# Altium schematic sheet CoreBoard.SchDoc
size B
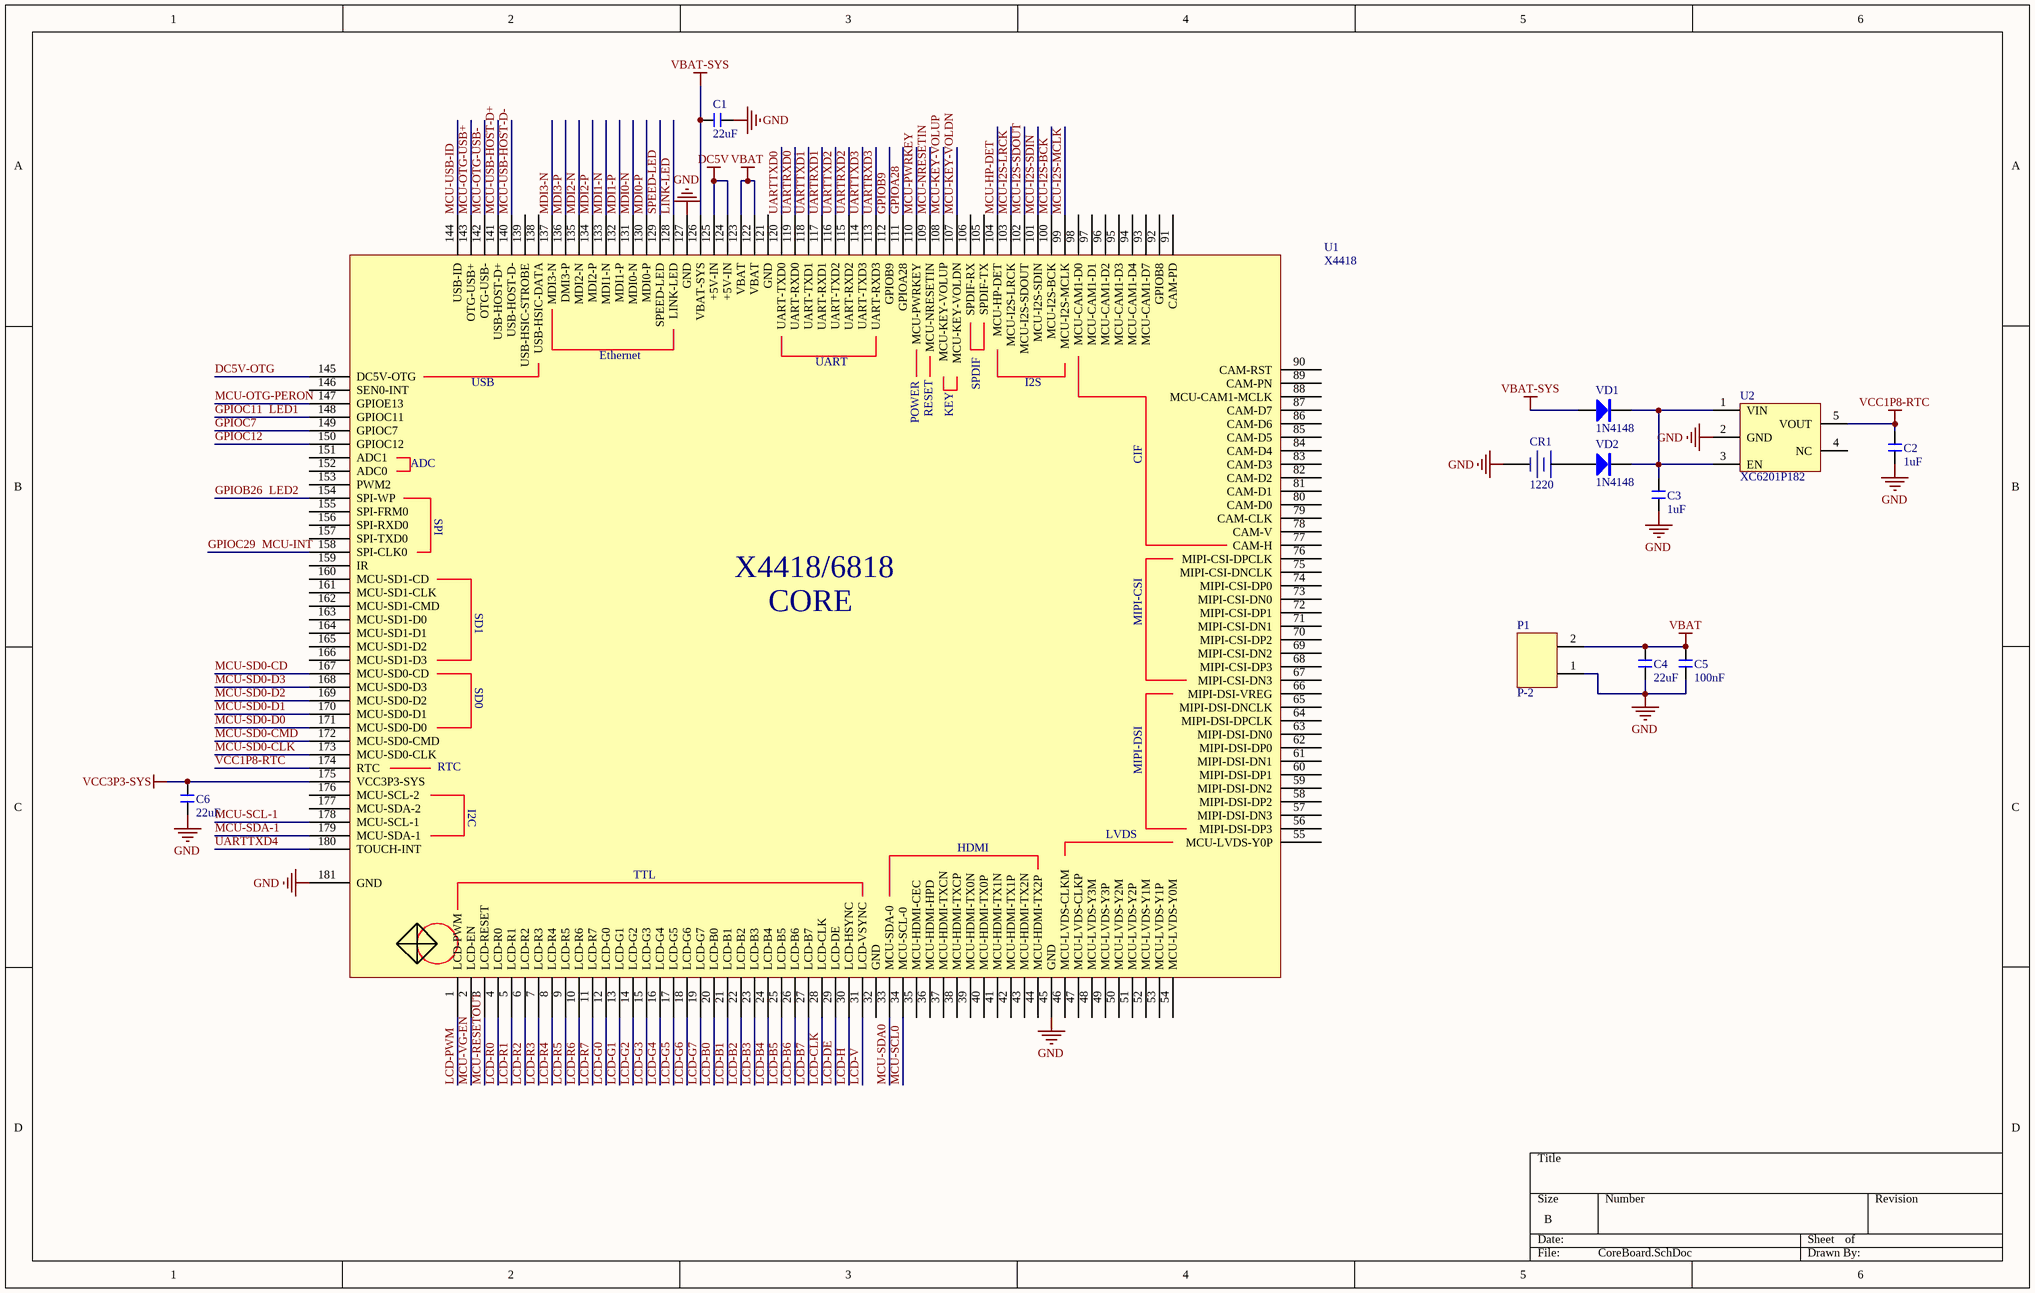
[diagram p0: CoreBoard.SchDoc]

## Parts
C1  22uF  [C 0805]
C2  1uF  [C 0402]
C3  1uF  [C 0402]
C4  22uF  [C 0805]
C5  100nF  [C 0402]
C6  22uF  [C 0805]
CR1  1220  [BATTERY CR1220_A]
P1  P-2  [P 2EDG3.5-2H]
U1  X4418  [CORE 4418/6818]
U2  XC6201P182  [SOT23-5M]
VD1  1N4148  [D SOD-323]
VD2  1N4148  [D SOD-323]

## Nets
DC5V: U1.124(+5V-IN) U1.125(+5V-IN)
GND: C1.2 C2.1 C3.1 C4.1 C5.1 C6.1 CR1.DC- P1.1 U1.45(GND) U1.127(GND) U1.181(GND) U2.2(GND)
VBAT: C4.2 C5.2 P1.2 U1.122(VBAT) U1.123(VBAT)
VBAT-SYS: C1.1 U1.126(VBAT-SYS) VD1.A
VCC1P8-RTC: C2.2 U1.174(RTC) U2.5(VOUT)
VCC3P3-SYS: C6.2 U1.175(VCC3P3-SYS)
DC5V-OTG: U1.145(DC5V-OTG)
GPIOA28: U1.111(GPIOA28)
GPIOB9: U1.112(GPIOB9)
GPIOB26: U1.154(SPI-WP)  [also labelled LED2]
GPIOC7: U1.149(GPIOC7)
GPIOC11: U1.148(GPIOC11)  [also labelled LED1]
GPIOC12: U1.150(GPIOC12)
GPIOC29: U1.158(SPI-CLK0)  [also labelled MCU-INT]
LCD-B0: U1.20(LCD-B0)
LCD-B1: U1.21(LCD-B1)
LCD-B2: U1.22(LCD-B2)
LCD-B3: U1.23(LCD-B3)
LCD-B4: U1.24(LCD-B4)
LCD-B5: U1.25(LCD-B5)
LCD-B6: U1.26(LCD-B6)
LCD-B7: U1.27(LCD-B7)
LCD-CLK: U1.28(LCD-CLK)
LCD-DE: U1.29(LCD-DE)
LCD-G0: U1.12(LCD-G0)
LCD-G1: U1.13(LCD-G1)
LCD-G2: U1.14(LCD-G2)
LCD-G3: U1.15(LCD-G3)
LCD-G4: U1.16(LCD-G4)
LCD-G5: U1.17(LCD-G5)
LCD-G6: U1.18(LCD-G6)
LCD-G7: U1.19(LCD-G7)
LCD-H: U1.30(LCD-HSYNC)
LCD-PWM: U1.1(LCD-PWM)
LCD-R0: U1.4(LCD-R0)
LCD-R1: U1.5(LCD-R1)
LCD-R2: U1.6(LCD-R2)
LCD-R3: U1.7(LCD-R3)
LCD-R4: U1.8(LCD-R4)
LCD-R5: U1.9(LCD-R5)
LCD-R6: U1.10(LCD-R6)
LCD-R7: U1.11(LCD-R7)
LCD-V: U1.31(LCD-VSYNC)
LINK-LED: U1.128(LINK-LED)
MCU-HP-DET: U1.104(MCU-HP-DET)
MCU-I2S-BCK: U1.100(MCU-I2S-BCK)
MCU-I2S-LRCK: U1.103(MCU-I2S-LRCK)
MCU-I2S-MCLK: U1.99(MCU-I2S-MCLK)
MCU-I2S-SDIN: U1.101(MCU-I2S-SDIN)
MCU-I2S-SDOUT: U1.102(MCU-I2S-SDOUT)
MCU-KEY-VOLDN: U1.107(MCU-KEY-VOLDN)
MCU-KEY-VOLUP: U1.108(MCU-KEY-VOLUP)
MCU-NRESETIN: U1.109(MCU-NRESETIN)
MCU-OTG-PERON: U1.147(GPIOE13)
MCU-OTG-USB+: U1.143(OTG-USB+)
MCU-OTG-USB-: U1.142(OTG-USB-)
MCU-PWRKEY: U1.110(MCU-PWRKEY)
MCU-RESETOUT: U1.3(LCD-RESET)
MCU-SCL0: U1.34(MCU-SCL-0)
MCU-SCL-1: U1.178(MCU-SCL-1)
MCU-SD0-CD: U1.167(MCU-SD0-CD)
MCU-SD0-CLK: U1.173(MCU-SD0-CLK)
MCU-SD0-CMD: U1.172(MCU-SD0-CMD)
MCU-SD0-D0: U1.171(MCU-SD0-D0)
MCU-SD0-D1: U1.170(MCU-SD0-D1)
MCU-SD0-D2: U1.169(MCU-SD0-D2)
MCU-SD0-D3: U1.168(MCU-SD0-D3)
MCU-SDA0: U1.33(MCU-SDA-0)
MCU-SDA-1: U1.179(MCU-SDA-1)
MCU-USB-HOST-D+: U1.141(USB-HOST-D+)
MCU-USB-HOST-D-: U1.140(USB-HOST-D-)
MCU-USB-ID: U1.144(USB-ID)
MCU-VG-EN: U1.2(LCD-EN)
MDI0-N: U1.131(MDI0-N)
MDI0-P: U1.130(MDI0-P)
MDI1-N: U1.133(MDI1-N)
MDI1-P: U1.132(MDI1-P)
MDI2-N: U1.135(MDI2-N)
MDI2-P: U1.134(MDI2-P)
MDI3-N: U1.137(MDI3-N)
MDI3-P: U1.136(DMI3-P)
SPEED-LED: U1.129(SPEED-LED)
UARTRXD0: U1.119(UART-RXD0)
UARTRXD1: U1.117(UART-RXD1)
UARTRXD2: U1.115(UART-RXD2)
UARTRXD3: U1.113(UART-RXD3)
UARTTXD0: U1.120(UART-TXD0)
UARTTXD1: U1.118(UART-TXD1)
UARTTXD2: U1.116(UART-TXD2)
UARTTXD3: U1.114(UART-TXD3)
UARTTXD4: U1.180(TOUCH-INT)
NetC3_2: C3.2 U2.1(VIN) U2.3(EN) VD1.K VD2.K
NetCR1_DC+: CR1.DC+ VD2.A

Not connected (* = marked no-connect by the designer): U1 32(GND) 35(MCU-HDMI-CEC) 36(MCU-HDMI-HPD) 37(MCU-HDMI-TXCN) 38(MCU-HDMI-TXCP) 39(MCU-HDMI-TX0N) 40(MCU-HDMI-TX0P) 41(MCU-HDMI-TX1N) 42(MCU-HDMI-TX1P) 43(MCU-HDMI-TX2N) 44(MCU-HDMI-TX2P) 46(MCU-LVDS-CLKM) 47(MCU-LVDS-CLKP) 48(MCU-LVDS-Y3M) 49(MCU-LVDS-Y3P) 50(MCU-LVDS-Y2M) 51(MCU-LVDS-Y2P) 52(MCU-LVDS-Y1M) 53(MCU-LVDS-Y1P) 54(MCU-LVDS-Y0M) 55(MCU-LVDS-Y0P) 56(MIPI-DSI-DP3) 57(MIPI-DSI-DN3) 58(MIPI-DSI-DP2) 59(MIPI-DSI-DN2) 60(MIPI-DSI-DP1) 61(MIPI-DSI-DN1) 62(MIPI-DSI-DP0) 63(MIPI-DSI-DN0) 64(MIPI-DSI-DPCLK) 65(MIPI-DSI-DNCLK) 66(MIPI-DSI-VREG) 67(MIPI-CSI-DN3) 68(MIPI-CSI-DP3) 69(MIPI-CSI-DN2) 70(MIPI-CSI-DP2) 71(MIPI-CSI-DN1) 72(MIPI-CSI-DP1) 73(MIPI-CSI-DN0) 74(MIPI-CSI-DP0) 75(MIPI-CSI-DNCLK) 76(MIPI-CSI-DPCLK) 77(CAM-H) 78(CAM-V) 79(CAM-CLK) 80(CAM-D0) 81(CAM-D1) 82(CAM-D2) 83(CAM-D3) 84(CAM-D4) 85(CAM-D5) 86(CAM-D6) 87(CAM-D7) 88(MCU-CAM1-MCLK) 89(CAM-PN) 90(CAM-RST) 91(CAM-PD) 92(GPIOB8) 93(MCU-CAM1-D7) 94(MCU-CAM1-D4) 95(MCU-CAM1-D3) 96(MCU-CAM1-D2) 97(MCU-CAM1-D1) 98(MCU-CAM1-D0) 105(SPDIF-TX) 106(SPDIF-RX) 121(GND) 138(USB-HSIC-DATA) 139(USB-HSIC-STROBE) 146(SEN0-INT) 151(ADC1) 152(ADC0) 153(PWM2) 155(SPI-FRM0) 156(SPI-RXD0) 157(SPI-TXD0) 159(IR) 160(MCU-SD1-CD) 161(MCU-SD1-CLK) 162(MCU-SD1-CMD) 163(MCU-SD1-D0) 164(MCU-SD1-D1) 165(MCU-SD1-D2) 166(MCU-SD1-D3) 176(MCU-SCL-2) 177(MCU-SDA-2); U2 4(NC)

## Notes on the sheet
- (in symbol CORE X4418/6818) Ethernet; UART; USB; SPDIF; I2S; RESET; KEY; POWER; CIF; ADC; SPI; X4418/6818; SD1; CORE; MIPI-CSI; SD0; MIPI-DSI; I2C; LVDS; HDMI; TTL

## Library data of the parts
C1 C4 C6 = C 22uF: 无极性贴片电容; 版权归属: 源创客; BOM名称: 无极性贴片电容; 学习资源: www.ooocke.com
C2 C3 = C 1uF: 无极性贴片电容; 版权归属: 源创客; BOM名称: 无极性贴片电容; 学习资源: www.ooocke.com
C5 = C 100nF: 无极性贴片电容; 版权归属: 源创客; BOM名称: 无极性贴片电容; 学习资源: www.ooocke.com
CR1 = BATTERY-CR-3V: 微型电池; 版权归属: 源创客; BOM名称: 微型电池; 学习资源: www.ooocke.com
P1 = P-2: 2脚接插件
U1 = CORE X4418/6818: 安卓核心板
U2 = XC6201P182: 1.8V线性稳压芯片
VD1 VD2 = 1N4148: 高速开关二极管; 版权归属: 源创客; BOM名称: 高速开关二极管; 学习资源: www.ooocke.com